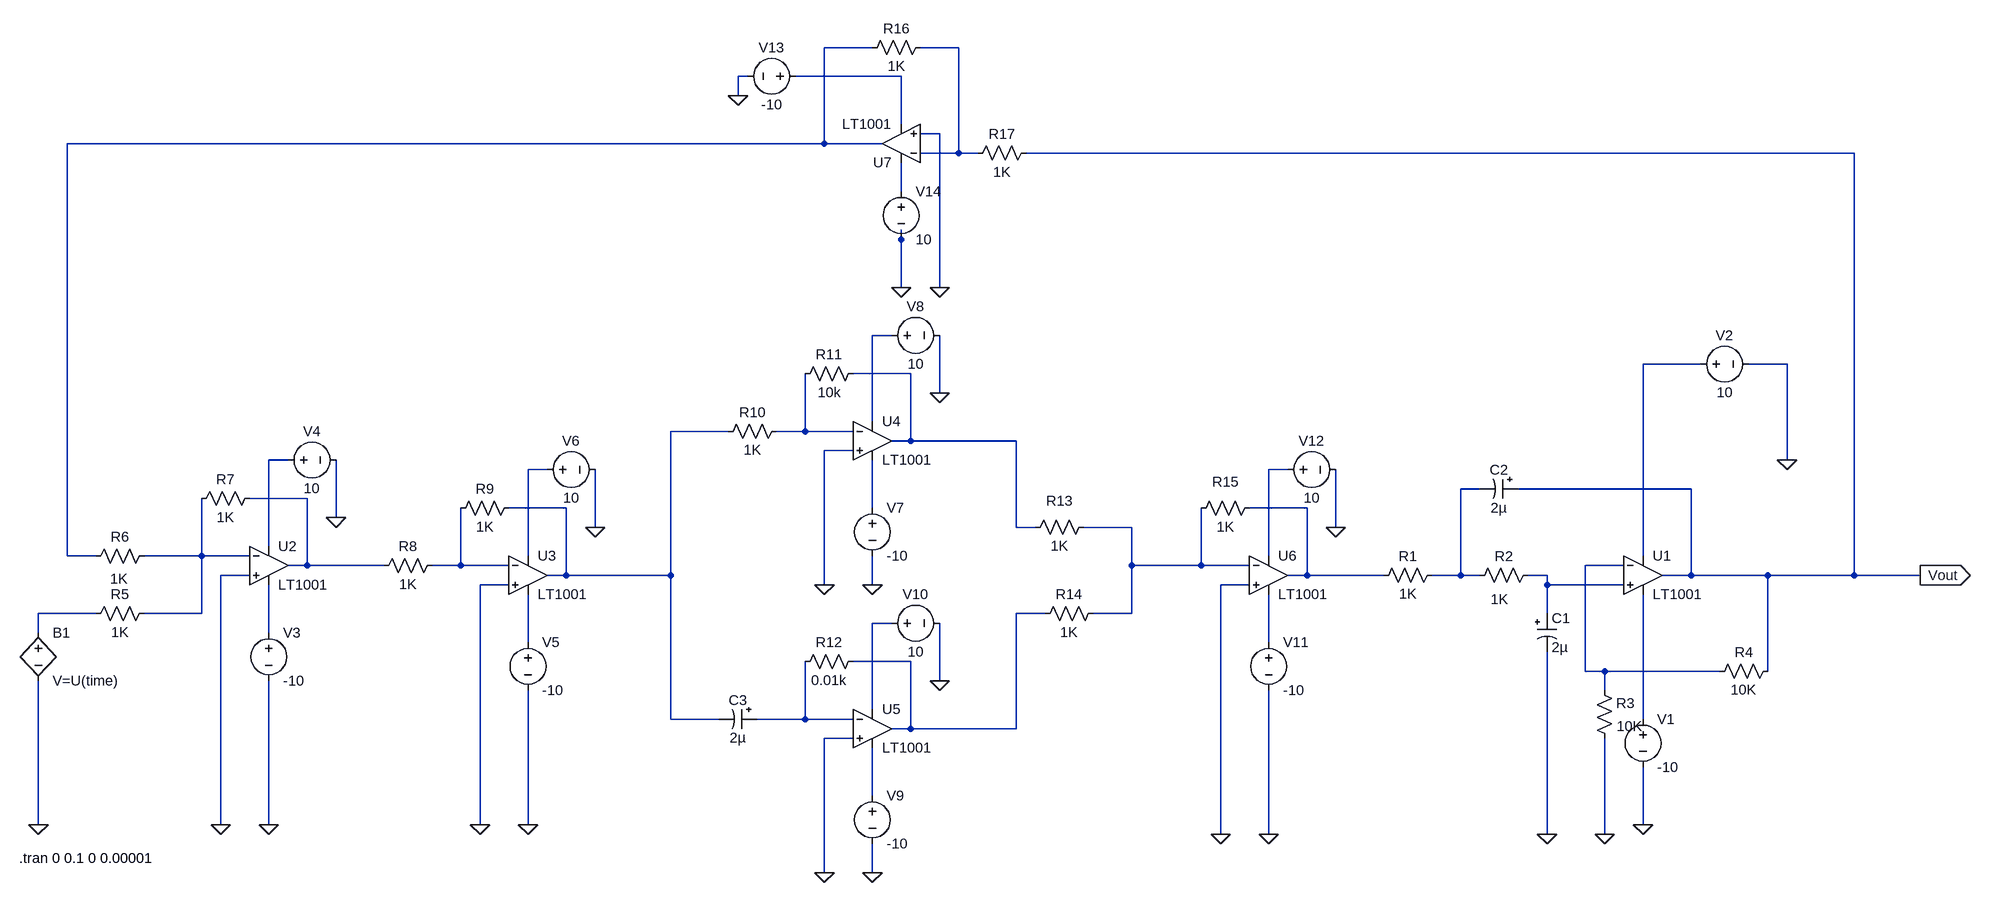
[diagram p0: schematic EC5030_Design Project_2021E171_Design2_Task3.asc]
EC5030_Design Project_2021E171_Design2_Task3.asc, the LTspice schematic file:
Version 4
SHEET 1 2544 1060
WIRE 672 -336 592 -336
WIRE 816 -336 752 -336
WIRE 464 -288 448 -288
WIRE 720 -288 544 -288
WIRE 448 -256 448 -288
WIRE 720 -208 720 -288
WIRE 784 -192 752 -192
WIRE 592 -176 592 -336
WIRE 592 -176 -720 -176
WIRE 688 -176 592 -176
WIRE 816 -160 816 -336
WIRE 816 -160 752 -160
WIRE 848 -160 816 -160
WIRE 2320 -160 928 -160
WIRE 720 -96 720 -144
WIRE 720 -16 720 -32
WIRE 720 64 720 -16
WIRE 784 64 784 -192
WIRE 704 144 672 144
WIRE 2064 192 1968 192
WIRE 2208 192 2144 192
WIRE 736 208 640 208
WIRE 784 240 784 144
WIRE 672 288 672 144
WIRE 432 304 336 304
WIRE 560 304 560 208
WIRE 560 304 512 304
WIRE 640 304 560 304
WIRE 736 320 736 208
WIRE 736 320 704 320
WIRE 912 320 736 320
WIRE 640 336 592 336
WIRE -352 352 -384 352
WIRE 2208 352 2208 192
WIRE 80 368 48 368
WIRE 1376 368 1344 368
WIRE 1696 400 1664 400
WIRE 2048 400 1760 400
WIRE -320 416 -416 416
WIRE 112 432 16 432
WIRE 672 432 672 352
WIRE 1408 432 1312 432
WIRE -272 448 -272 352
WIRE 160 464 160 368
WIRE 912 464 912 320
WIRE 944 464 912 464
WIRE 1104 464 1024 464
WIRE 1456 464 1456 368
WIRE -384 496 -384 352
WIRE -720 512 -720 -176
WIRE -672 512 -720 512
WIRE -496 512 -496 416
WIRE -496 512 -592 512
WIRE -416 512 -496 512
WIRE 48 512 48 368
WIRE 1344 512 1344 368
WIRE 1968 512 1968 192
WIRE -320 528 -320 416
WIRE -320 528 -352 528
WIRE -192 528 -320 528
WIRE -64 528 -64 432
WIRE -64 528 -112 528
WIRE 16 528 -64 528
WIRE 1104 528 1104 464
WIRE 1232 528 1232 432
WIRE 1232 528 1104 528
WIRE 1312 528 1232 528
WIRE 1936 528 1872 528
WIRE -416 544 -464 544
WIRE 112 544 112 432
WIRE 112 544 80 544
WIRE 336 544 336 304
WIRE 336 544 112 544
WIRE 1408 544 1408 432
WIRE 1408 544 1376 544
WIRE 1536 544 1408 544
WIRE 1664 544 1664 400
WIRE 1664 544 1616 544
WIRE 1696 544 1664 544
WIRE 1808 544 1776 544
WIRE 2048 544 2048 400
WIRE 2048 544 2000 544
WIRE 2176 544 2048 544
WIRE 2320 544 2320 -160
WIRE 2320 544 2176 544
WIRE 2432 544 2320 544
WIRE 16 560 -32 560
WIRE 592 560 592 336
WIRE 672 560 672 512
WIRE 1312 560 1264 560
WIRE 1808 560 1808 544
WIRE 1936 560 1808 560
WIRE -672 608 -768 608
WIRE -496 608 -496 512
WIRE -496 608 -592 608
WIRE 960 608 912 608
WIRE 1104 608 1104 528
WIRE 1104 608 1040 608
WIRE 1808 608 1808 560
WIRE 704 624 672 624
WIRE -768 640 -768 608
WIRE -384 640 -384 560
WIRE 48 656 48 576
WIRE 1344 656 1344 576
WIRE 736 688 640 688
WIRE 1872 704 1872 528
WIRE 1904 704 1872 704
WIRE 2096 704 1904 704
WIRE 2176 704 2176 544
WIRE 784 720 784 624
WIRE 1904 736 1904 704
WIRE 672 768 672 624
WIRE 336 784 336 544
WIRE 416 784 336 784
WIRE 560 784 560 688
WIRE 560 784 480 784
WIRE 640 784 560 784
WIRE 1968 784 1968 576
WIRE 736 800 736 688
WIRE 736 800 704 800
WIRE 912 800 912 608
WIRE 912 800 736 800
WIRE 640 816 592 816
WIRE 672 912 672 832
WIRE -768 960 -768 720
WIRE -464 960 -464 544
WIRE -384 960 -384 720
WIRE -32 960 -32 560
WIRE 48 960 48 736
WIRE 1968 960 1968 864
WIRE 1264 976 1264 560
WIRE 1344 976 1344 736
WIRE 1808 976 1808 672
WIRE 1904 976 1904 816
WIRE 592 1040 592 816
WIRE 672 1040 672 992
FLAG 1904 976 0
FLAG 1808 976 0
FLAG 1968 960 0
FLAG 2208 352 0
FLAG 1456 464 0
FLAG 1344 976 0
FLAG 1264 976 0
FLAG 784 240 0
FLAG 672 560 0
FLAG 592 560 0
FLAG 160 464 0
FLAG 48 960 0
FLAG -32 960 0
FLAG -272 448 0
FLAG -384 960 0
FLAG -464 960 0
FLAG -768 960 0
FLAG 720 64 0
FLAG 448 -256 0
FLAG 784 720 0
FLAG 672 1040 0
FLAG 592 1040 0
FLAG 784 64 0
FLAG 2432 544 Vout
IOPIN 2432 544 Out
SYMBOL voltage -384 624 R0
WINDOW 123 0 0 Left 0
WINDOW 39 0 0 Left 0
SYMATTR InstName V3
SYMATTR Value -10
SYMBOL voltage 2048 192 R270
WINDOW 0 32 56 VTop 2
WINDOW 3 -32 56 VBottom 2
WINDOW 123 0 0 Left 0
WINDOW 39 0 0 Left 0
SYMATTR InstName V2
SYMATTR Value 10
SYMBOL res -576 496 R90
WINDOW 0 0 56 VBottom 2
WINDOW 3 39 58 VTop 2
SYMATTR InstName R6
SYMATTR Value 1K
SYMBOL polcap 1792 608 R0
SYMATTR InstName C1
SYMATTR Value 2µ
SYMBOL polcap 1760 384 R90
WINDOW 0 0 32 VBottom 2
WINDOW 3 32 32 VTop 2
SYMATTR InstName C2
SYMATTR Value 2µ
SYMBOL OpAmps\\LT1001 1968 480 R0
SYMATTR InstName U1
SYMBOL res 1888 720 R0
WINDOW 0 51 53 Bottom 2
SYMATTR InstName R3
SYMATTR Value 10K
SYMBOL res 1632 528 R90
WINDOW 0 0 56 VBottom 2
WINDOW 3 32 56 VTop 2
SYMATTR InstName R1
SYMATTR Value 1K
SYMBOL OpAmps\\LT1001 1344 480 R0
SYMATTR InstName U6
SYMBOL voltage 1968 768 R0
WINDOW 123 0 0 Left 0
WINDOW 39 0 0 Left 0
SYMATTR InstName V1
SYMATTR Value -10
SYMBOL voltage 688 624 R270
WINDOW 0 32 56 VTop 2
WINDOW 3 -32 56 VBottom 2
WINDOW 123 0 0 Left 0
WINDOW 39 0 0 Left 0
SYMATTR InstName V10
SYMATTR Value 10
SYMBOL res 2192 688 R90
WINDOW 0 0 56 VBottom 2
WINDOW 3 32 56 VTop 2
SYMATTR InstName R4
SYMATTR Value 10K
SYMBOL res 656 192 R90
WINDOW 0 0 56 VBottom 2
WINDOW 3 32 56 VTop 2
SYMATTR InstName R11
SYMATTR Value 10k
SYMBOL OpAmps\\LT1001 672 256 R0
SYMATTR InstName U4
SYMBOL voltage 48 640 R0
WINDOW 123 0 0 Left 0
WINDOW 39 0 0 Left 0
SYMATTR InstName V5
SYMATTR Value -10
SYMBOL voltage -368 352 R270
WINDOW 0 32 56 VTop 2
WINDOW 3 -32 56 VBottom 2
WINDOW 123 0 0 Left 0
WINDOW 39 0 0 Left 0
SYMATTR InstName V4
SYMATTR Value 10
SYMBOL res -96 512 R90
WINDOW 0 0 56 VBottom 2
WINDOW 3 32 56 VTop 2
SYMATTR InstName R8
SYMATTR Value 1K
SYMBOL res 32 416 R90
WINDOW 0 0 56 VBottom 2
WINDOW 3 32 56 VTop 2
SYMATTR InstName R9
SYMATTR Value 1K
SYMBOL OpAmps\\LT1001 48 480 R0
SYMATTR InstName U3
SYMBOL voltage 672 416 R0
WINDOW 123 0 0 Left 0
WINDOW 39 0 0 Left 0
SYMATTR InstName V7
SYMATTR Value -10
SYMBOL voltage 688 144 R270
WINDOW 0 32 56 VTop 2
WINDOW 3 -32 56 VBottom 2
WINDOW 123 0 0 Left 0
WINDOW 39 0 0 Left 0
SYMATTR InstName V8
SYMATTR Value 10
SYMBOL res 528 288 R90
WINDOW 0 0 56 VBottom 2
WINDOW 3 32 56 VTop 2
SYMATTR InstName R10
SYMATTR Value 1K
SYMBOL res 1328 416 R90
WINDOW 0 -12 56 VBottom 2
WINDOW 3 32 56 VTop 2
SYMATTR InstName R15
SYMATTR Value 1K
SYMBOL OpAmps\\LT1001 -384 464 R0
SYMATTR InstName U2
SYMBOL voltage 1344 640 R0
WINDOW 123 0 0 Left 0
WINDOW 39 0 0 Left 0
SYMATTR InstName V11
SYMATTR Value -10
SYMBOL voltage 1360 368 R270
WINDOW 0 32 56 VTop 2
WINDOW 3 -32 56 VBottom 2
WINDOW 123 0 0 Left 0
WINDOW 39 0 0 Left 0
SYMATTR InstName V12
SYMATTR Value 10
SYMBOL res 656 672 R90
WINDOW 0 0 56 VBottom 2
WINDOW 3 32 56 VTop 2
SYMATTR InstName R12
SYMATTR Value 0.01k
SYMBOL res -400 400 R90
WINDOW 0 0 56 VBottom 2
WINDOW 3 32 56 VTop 2
SYMATTR InstName R7
SYMATTR Value 1K
SYMBOL res -576 592 R90
WINDOW 0 0 56 VBottom 2
WINDOW 3 32 56 VTop 2
SYMATTR InstName R5
SYMATTR Value 1K
SYMBOL res 768 -352 R90
WINDOW 0 0 56 VBottom 2
WINDOW 3 32 56 VTop 2
SYMATTR InstName R16
SYMATTR Value 1K
SYMBOL OpAmps\\LT1001 720 -112 R180
SYMATTR InstName U7
SYMBOL res 1792 528 R90
WINDOW 0 0 56 VBottom 2
WINDOW 3 41 63 VTop 2
SYMATTR InstName R2
SYMATTR Value 1K
SYMBOL res 944 -176 R90
WINDOW 0 0 56 VBottom 2
WINDOW 3 32 56 VTop 2
SYMATTR InstName R17
SYMATTR Value 1K
SYMBOL voltage 720 -112 R0
WINDOW 123 0 0 Left 0
WINDOW 39 0 0 Left 0
SYMATTR InstName V14
SYMATTR Value 10
SYMBOL voltage 560 -288 R90
WINDOW 0 -32 56 VBottom 2
WINDOW 3 32 56 VTop 2
WINDOW 123 0 0 Left 0
WINDOW 39 0 0 Left 0
SYMATTR InstName V13
SYMATTR Value -10
SYMBOL OpAmps\\LT1001 672 736 R0
SYMATTR InstName U5
SYMBOL voltage 672 896 R0
WINDOW 123 0 0 Left 0
WINDOW 39 0 0 Left 0
SYMATTR InstName V9
SYMATTR Value -10
SYMBOL voltage 64 368 R270
WINDOW 0 32 56 VTop 2
WINDOW 3 -32 56 VBottom 2
WINDOW 123 0 0 Left 0
WINDOW 39 0 0 Left 0
SYMATTR InstName V6
SYMATTR Value 10
SYMBOL polcap 480 768 R90
WINDOW 0 0 32 VBottom 2
WINDOW 3 32 32 VTop 2
SYMATTR InstName C3
SYMATTR Value 2µ
SYMBOL res 1056 592 R90
WINDOW 0 0 56 VBottom 2
WINDOW 3 32 56 VTop 2
SYMATTR InstName R14
SYMATTR Value 1K
SYMBOL res 1040 448 R90
WINDOW 0 -12 56 VBottom 2
WINDOW 3 32 56 VTop 2
SYMATTR InstName R13
SYMATTR Value 1K
SYMBOL bv -768 624 R0
SYMATTR InstName B1
SYMATTR Value V=U(time)
TEXT -800 1016 Left 2 !.tran 0 0.1 0 0.00001

The netlist it stands for:
* EC5030_Design Project_2021E171_Design2_Task3.asc
V3 N025 0 -10
V2 N006 0 10
R6 N018 N001 1K
C1 N021 0 2µ
C2 Vout N013 2µ
XU1 N021 N020 N006 N029 Vout LT1001  ; pins In+ In- V+ V- OUT
R3 N020 0 10K
R1 N013 N016 1K
XU6 0 N017 N012 N027 N016 LT1001  ; pins In+ In- V+ V- OUT
V1 N029 0 -10
V10 N024 0 10
R4 Vout N020 10K
R11 N007 N009 10k
XU4 0 N009 N005 N015 N007 LT1001  ; pins In+ In- V+ V- OUT
V5 N026 0 -10
V4 N010 0 10
R8 N019 N014 1K
R9 N008 N019 1K
XU3 0 N019 N011 N026 N008 LT1001  ; pins In+ In- V+ V- OUT
V7 N015 0 -10
V8 N005 0 10
R10 N009 N008 1K
R15 N016 N017 1K
XU2 0 N018 N010 N025 N014 LT1001  ; pins In+ In- V+ V- OUT
V11 N027 0 -10
V12 N012 0 10
R12 N023 N028 0.01k
R7 N014 N018 1K
R5 N018 N022 1K
R16 N002 N001 1K
XU7 0 N002 N004 N003 N001 LT1001  ; pins In+ In- V+ V- OUT
R2 N021 N013 1K
R17 Vout N002 1K
V14 N004 0 10
V13 N003 0 -10
XU5 0 N028 N024 N030 N023 LT1001  ; pins In+ In- V+ V- OUT
V9 N030 0 -10
V6 N011 0 10
C3 N028 N008 2µ
R14 N017 N023 1K
R13 N017 N007 1K
B1 N022 0 V=U(time)
.tran 0 0.1 0 0.00001
.lib LTC.lib
.backanno
.end